# Altium project Propeller.PrjPcb
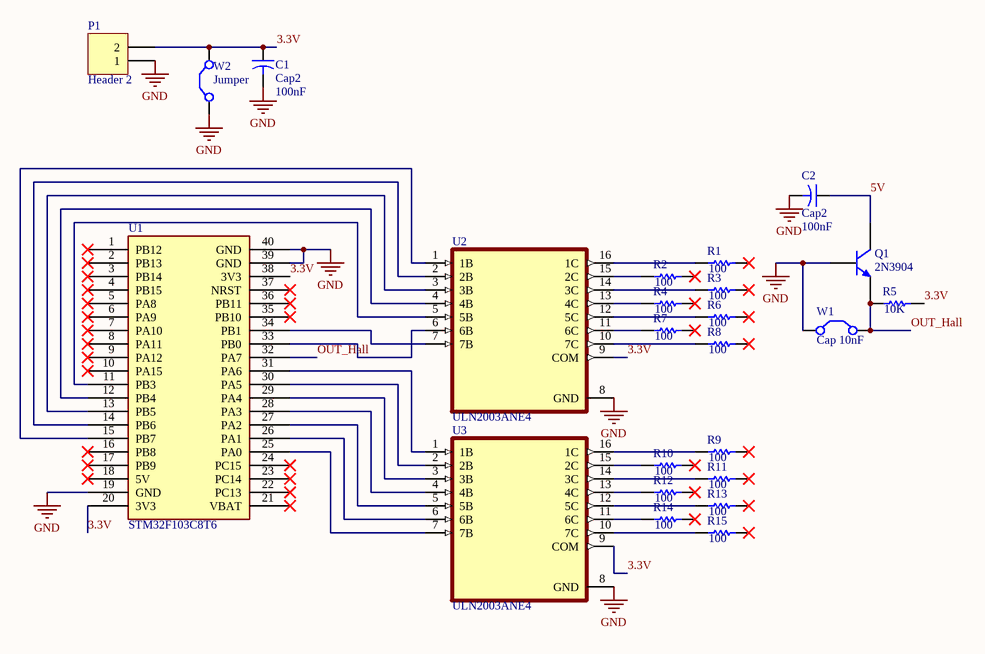
[diagram p0: sch_propeller.SchDoc]
1 sheet, 24 parts. Net scope: global (net labels, ports and power ports of the same name join across sheets).
Board file: pcb_propeller.PcbDoc

## Sheet sch_propeller.SchDoc
size A4; SheetNumber: 1; SheetTotal: 1

### Parts
C1  Cap2  value 100nF  [CAPR5-4X5]
C2  Cap2  value 100nF  [CAPR5-4X5]
P1  Header 2  [HDR1X2]
Q1  2N3904  [TO-92A]
R1  value 100  [AXIAL-0.3]  (hidden comment: Res1)
R2  value 100  [AXIAL-0.3]  (hidden comment: Res1)
R3  value 100  [AXIAL-0.3]  (hidden comment: Res1)
R4  value 100  [AXIAL-0.3]  (hidden comment: Res1)
R5  value 10K  [AXIAL-0.3]  (hidden comment: Res1)
R6  value 100  [AXIAL-0.3]  (hidden comment: Res1)
R7  value 100  [AXIAL-0.3]  (hidden comment: Res1)
R8  value 100  [AXIAL-0.3]  (hidden comment: Res1)
R9  value 100  [AXIAL-0.3]  (hidden comment: Res1)
R10  value 100  [AXIAL-0.3]  (hidden comment: Res1)
R11  value 100  [AXIAL-0.3]  (hidden comment: Res1)
R12  value 100  [AXIAL-0.3]  (hidden comment: Res1)
R13  value 100  [AXIAL-0.3]  (hidden comment: Res1)
R14  value 100  [AXIAL-0.3]  (hidden comment: Res1)
R15  value 100  [AXIAL-0.3]  (hidden comment: Res1)
U1  STM32F103C8T6  [Stm32 BluePill]
U2  ULN2003ANE4  [DIP794W45P254L1969H508Q16]
U3  ULN2003ANE4  [DIP794W45P254L1969H508Q16]
W1  Cap 10nF  [RAD-0.2]
W2  Jumper  [RAD-0.2]

### Nets
GND: C1.2 C2.2 P1.1 Q1.2(B) U1.19(GND) U1.39(GND) U1.40(GND) U2.8(GND) U3.8(GND) W1.1(C1) W2.1(C1)
3.3V: C1.1 P1.2 R5.2 U1.20(3V3) U1.38(3V3) U2.9(COM) U3.9(COM) W2.2(C2)
5V: C2.1 Q1.3(C)
OUT_Hall: Q1.1(E) R5.1 U1.32(PA7) W1.2(C2)
NetR1_1: R1.1 U2.16(1C)
NetR2_1: R2.1 U2.15(2C)
NetR3_1: R3.1 U2.14(3C)
NetR4_1: R4.1 U2.13(4C)
NetR6_1: R6.1 U2.12(5C)
NetR7_1: R7.1 U2.11(6C)
NetR8_1: R8.1 U2.10(7C)
NetR9_1: R9.1 U3.16(1C)
NetR10_1: R10.1 U3.15(2C)
NetR11_1: R11.1 U3.14(3C)
NetR12_1: R12.1 U3.13(4C)
NetR13_1: R13.1 U3.12(5C)
NetR14_1: R14.1 U3.11(6C)
NetR15_1: R15.1 U3.10(7C)
NetU1_11: U1.11(PB3) U2.5(5B)
NetU1_12: U1.12(PB4) U2.4(4B)
NetU1_13: U1.13(PB5) U2.3(3B)
NetU1_14: U1.14(PB6) U2.2(2B)
NetU1_15: U1.15(PB7) U2.1(1B)
NetU1_25: U1.25(PA0) U3.7(7B)
NetU1_26: U1.26(PA1) U3.6(6B)
NetU1_27: U1.27(PA2) U3.5(5B)
NetU1_28: U1.28(PA3) U3.4(4B)
NetU1_29: U1.29(PA4) U3.3(3B)
NetU1_30: U1.30(PA5) U3.2(2B)
NetU1_31: U1.31(PA6) U3.1(1B)
NetU1_33: U1.33(PB0) U2.6(6B)
NetU1_34: U1.34(PB1) U2.7(7B)

Not connected (* = marked no-connect by the designer): R1 2*; R2 2*; R3 2*; R4 2*; R6 2*; R7 2*; R8 2*; R9 2*; R10 2*; R11 2*; R12 2*; R13 2*; R14 2*; R15 2*; U1 1(PB12)* 2(PB13)* 3(PB14)* 4(PB15)* 5(PA8)* 6(PA9)* 7(PA10)* 8(PA11)* 9(PA12)* 10(PA15)* 16(PB8)* 17(PB9)* 18(5V)* 21(VBAT)* 22(PC13)* 23(PC14)* 24(PC15)* 35(PB10)* 36(PB11)* 37(NRST)*

### Library data of the parts
C1 C2 = Cap2: Capacitor; Published: 23-Sep-2002; PackageReference: CAPR5-4X5; Publisher: Altium Limited; PackageDescription: Capacitor; 2 Leads
P1 = Header 2: Header, 2-Pin; LatestRevisionDate: 17-Jul-2002; LatestRevisionNote: Re-released for DXP Platform.; Publisher: Altium Limited
Q1 = 2N3904: NPN General Purpose Amplifier; Published: 8-Jun-2000; LatestRevisionDate: 15-Jan-2003; LatestRevisionNote: PCB Footprint 'BCY-W3/D4.7' replaced; DatasheetVersion: 1997; PackageVersion: Sep-1998; PackageReference: TO-92A; Publisher: Altium Limited; PackageDescription: TO, Flat Index; 3 In-Line, Axial Leads; Body Dia. 4.5mm; Leads 0.51 x 0.48 mm (max); ComponentLink1Description: Manufacturer Link; ComponentLink1URL: http://www.fairchildsemi.com/; ComponentLink2Description: Datasheet; ComponentLink2URL: http://www.fairchildsemi.com/ds/2N%2F2N3904.pdf
R1-R15 = Res1: Resistor; Published: 8-Jun-2000; LatestRevisionDate: 17-Jul-2002; LatestRevisionNote: Re-released for DXP Platform.; PackageReference: AXIAL-0.3; Publisher: Altium Limited; PackageDescription: Axial Device, Thru-Hole; 2 Leads; 0.3 in Pin Spacing
U1 = BluePill: Designed By @Alixahedi
U2 U3 = ULN2003ANE4: 50-V, 7-ch darlington transistor array, -20C to 70C; MF: Texas Instruments; SnapEDA_Link: https://www.snapeda.com/parts/ULN2003ANE4/Texas+Instruments/view-part/?ref=snap; Package: PDIP-16 Texas Instruments; Value: *; MP: ULN2003ANE4; Check_prices: https://www.snapeda.com/parts/ULN2003ANE4/Texas+Instruments/view-part/?ref=eda
W1 W2 = Jumper: Jumper Wire; Published: 24-Mar-1999; LatestRevisionDate: 17-Jul-2002; LatestRevisionNote: Re-released for DXP Platform.; PackageReference: RAD-0.2; Publisher: Altium Limited; PackageDescription: Radial Cap, Thru-Hole; 2 Leads; 0.2 in Pin Spacing